# Altium schematic sheet Pr7.SCHDOC
size 297 x 209 mm; SheetNumber: 1; SheetTotal: 1; DocumentName: Sheet1.SCHDOC
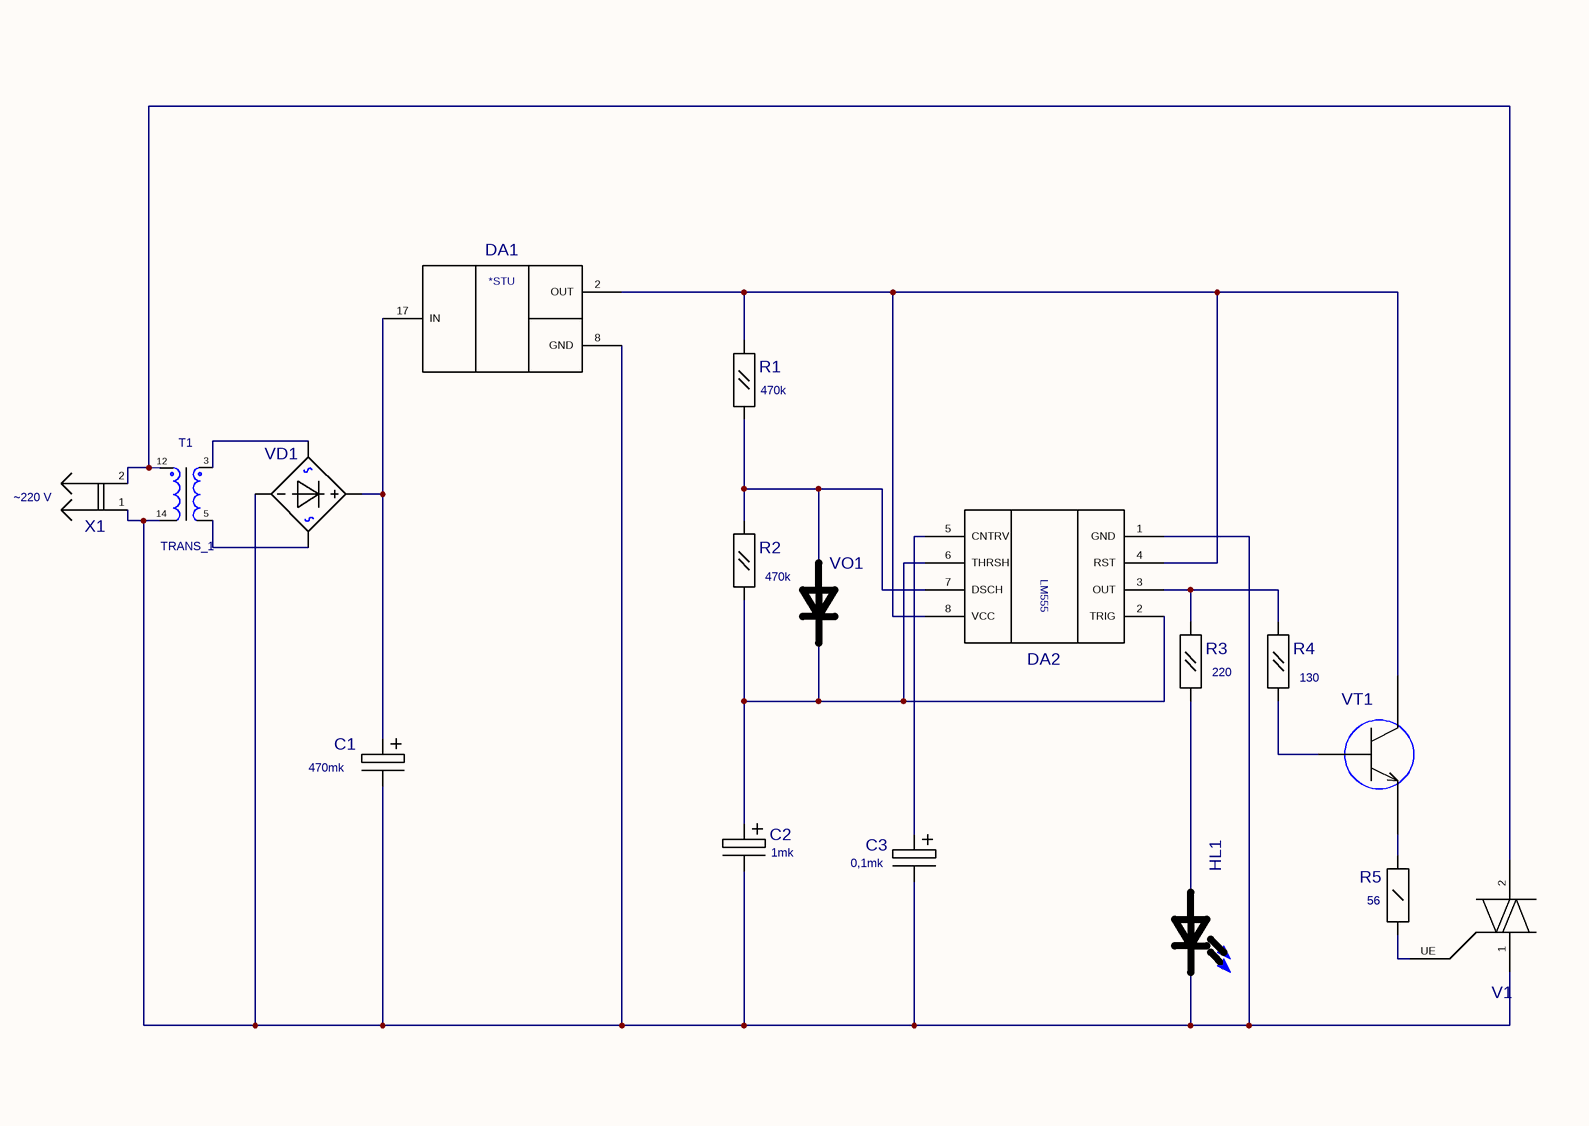
[diagram p0: Pr7.SCHDOC]

## Parts
C1  value 470mk  [R50-35-08XX_K5035-2R]  (hidden comment: К50-35-470МКФ-10В)
C2  value 1mk  [К50-35-0511_K5035-1R]  (hidden comment: К50-35-1МКФ-50В)
C3  value 0,1mk  [К50-35-08XX-Г_K5035-2R]  (hidden comment: К50-35-0,1МКФ-50В)
DA1  КР142ЕН5А  [TO-220-KT-28-2]  (value not drawn)
DA2  LM555CM  [SO-8]  (value not drawn)
HL1  ИПД156  [3528]  (value not drawn)
R1  value 470k  [C2-33H-0.125W]  (hidden comment: C2-33H-0.125W_OLD_UGO)
R2  value 470k  [C2-33H-0.125W]  (hidden comment: C2-33H-0.125W_OLD_UGO)
R3  value 220  [C2-33H-0.125W]  (hidden comment: C2-33H-0.125W_OLD_UGO)
R4  value 130  [C2-33H-0.125W]  (hidden comment: C2-33H-0.125W_OLD_UGO)
R5  value 56  [C2-33H-0.25W]  (hidden comment: C2-33H-0.25W_OLD_UGO)
T1  TRANS_1  [TRANS_1_TRANS_1(Primary)]
V1  TC122  [КУ202_КУ202А(Primary)]  (value not drawn)
VD1  2Д2136АС  [2Д2136АС]  (value not drawn)
VO1  1N34  [DO-7]  (value not drawn)
VT1  КТ315Б  [KT13_КТ315Б(KT13-1)]  (value not drawn)
X1  value ~220 V  [2XR]  (hidden comment: 2XR)

## Nets
NetC1_1: C1.1 DA1.17(IN) VD1.5(+)
NetC1_2: C1.2 C2.2 C3.2 DA1.8(GND) DA2.1(GND) HL1.1(K) T1.14 V1.1(E2) VD1.4(-) X1.1(I/O1)
NetC2_1: C2.1 DA2.2(TRIG) DA2.6(THRSH) R2.1 VO1.K
NetC3_1: C3.1 DA2.5(CNTRV)
NetDA1_2: DA1.2(OUT) DA2.4(RST) DA2.8(VCC) R1.1 VT1.3(K)
NetDA2_3: DA2.3(OUT) R3.2 R4.2
NetDA2_7: DA2.7(DSCH) R1.2 R2.2 VO1.A
NetHL1_2: HL1.2(A) R3.1
NetR4_1: R4.1 VT1.2(B)
NetR5_1: R5.1 V1.UE
NetR5_2: R5.2 VT1.1(E)
NetT1_3: T1.3 VD1.1
NetT1_5: T1.5 VD1.3
NetT1_12: T1.12 V1.2(E1) X1.2(I/O2)

Not connected (* = marked no-connect by the designer): DA1 4; V1 4 5; VD1 2

## Notes on the sheet
- (in symbol LM555CM) LM555
- (in symbol КР142ЕН5А) *STU

## Library data of the parts
R1-R4 = C2-33H-0.125W_OLD_UGO: Autor: pcbdesigner.ru
R5 = C2-33H-0.25W_OLD_UGO: Autor: pcbdesigner.ru
DA1 = КР142ЕН5А: Value: *
DA2 = LM555CM: Value: *
T1 = TRANS_1: Value: *
V1 = TC122: Value: *
VD1 = 2Д2136АС: Value: *
VO1 = 1N34: Value: *
VT1 = КТ315Б: Value: *